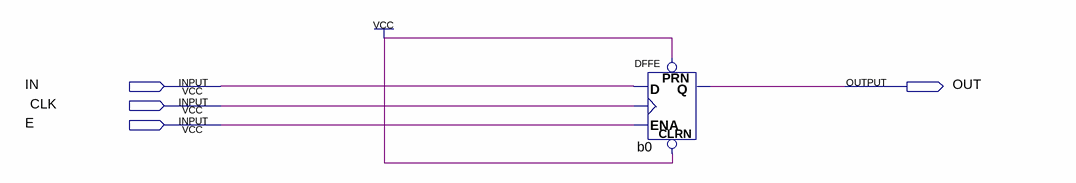
[diagram p0: schematic sheet]
// Quartus schematic reg1.bdf as structural Verilog: 1 symbols, 4 pins
module reg1 (
  input  IN,
  input  CLK,
  input  E,
  output OUT
);

  DFFE b0 (.PRN(1'b1), .CLRN(1'b1), .D(IN), .CLK(CLK), .ENA(E), .Q(OUT));
endmodule
